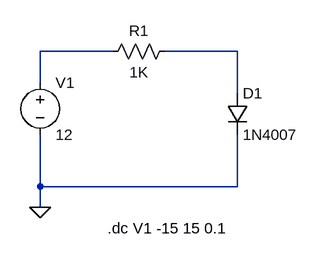
[diagram p0: schematic Diode Selection for a Real Application.asc]
Diode Selection for a Real Application.asc, the LTspice schematic file:
Version 4.1
SHEET 1 880 680
WIRE 176 80 64 80
WIRE 368 80 256 80
WIRE 64 128 64 80
WIRE 368 144 368 80
WIRE 64 288 64 208
WIRE 368 288 368 208
WIRE 368 288 64 288
WIRE 64 320 64 288
FLAG 64 320 0
SYMBOL voltage 64 112 R0
SYMATTR InstName V1
SYMATTR Value 12
SYMBOL res 272 64 R90
WINDOW 0 0 56 VBottom 2
WINDOW 3 32 56 VTop 2
SYMATTR InstName R1
SYMATTR Value 1K
SYMBOL diode 352 144 R0
SYMATTR InstName D1
SYMATTR Value 1N4007
TEXT 168 352 Left 2 !.dc V1 -15 15 0.1

The netlist it stands for:
* Diode Selection for a Real Application.asc
V1 N001 0 12
R1 N002 N001 1K
D1 N002 0 1N4007
.model D D
.lib standard.dio
.dc V1 -15 15 0.1
.backanno
.end